# Altium schematic sheet Receiver-Sheet.SchDoc: 15W QI Wireless Charging Receiver
size 420 x 297 mm; SheetNumber: 1; SheetTotal: 1; ENG_APP_DATE: --/--/--; DSN_APP_DATE: --/--/--; CHK_APP_DATE: --/--/--
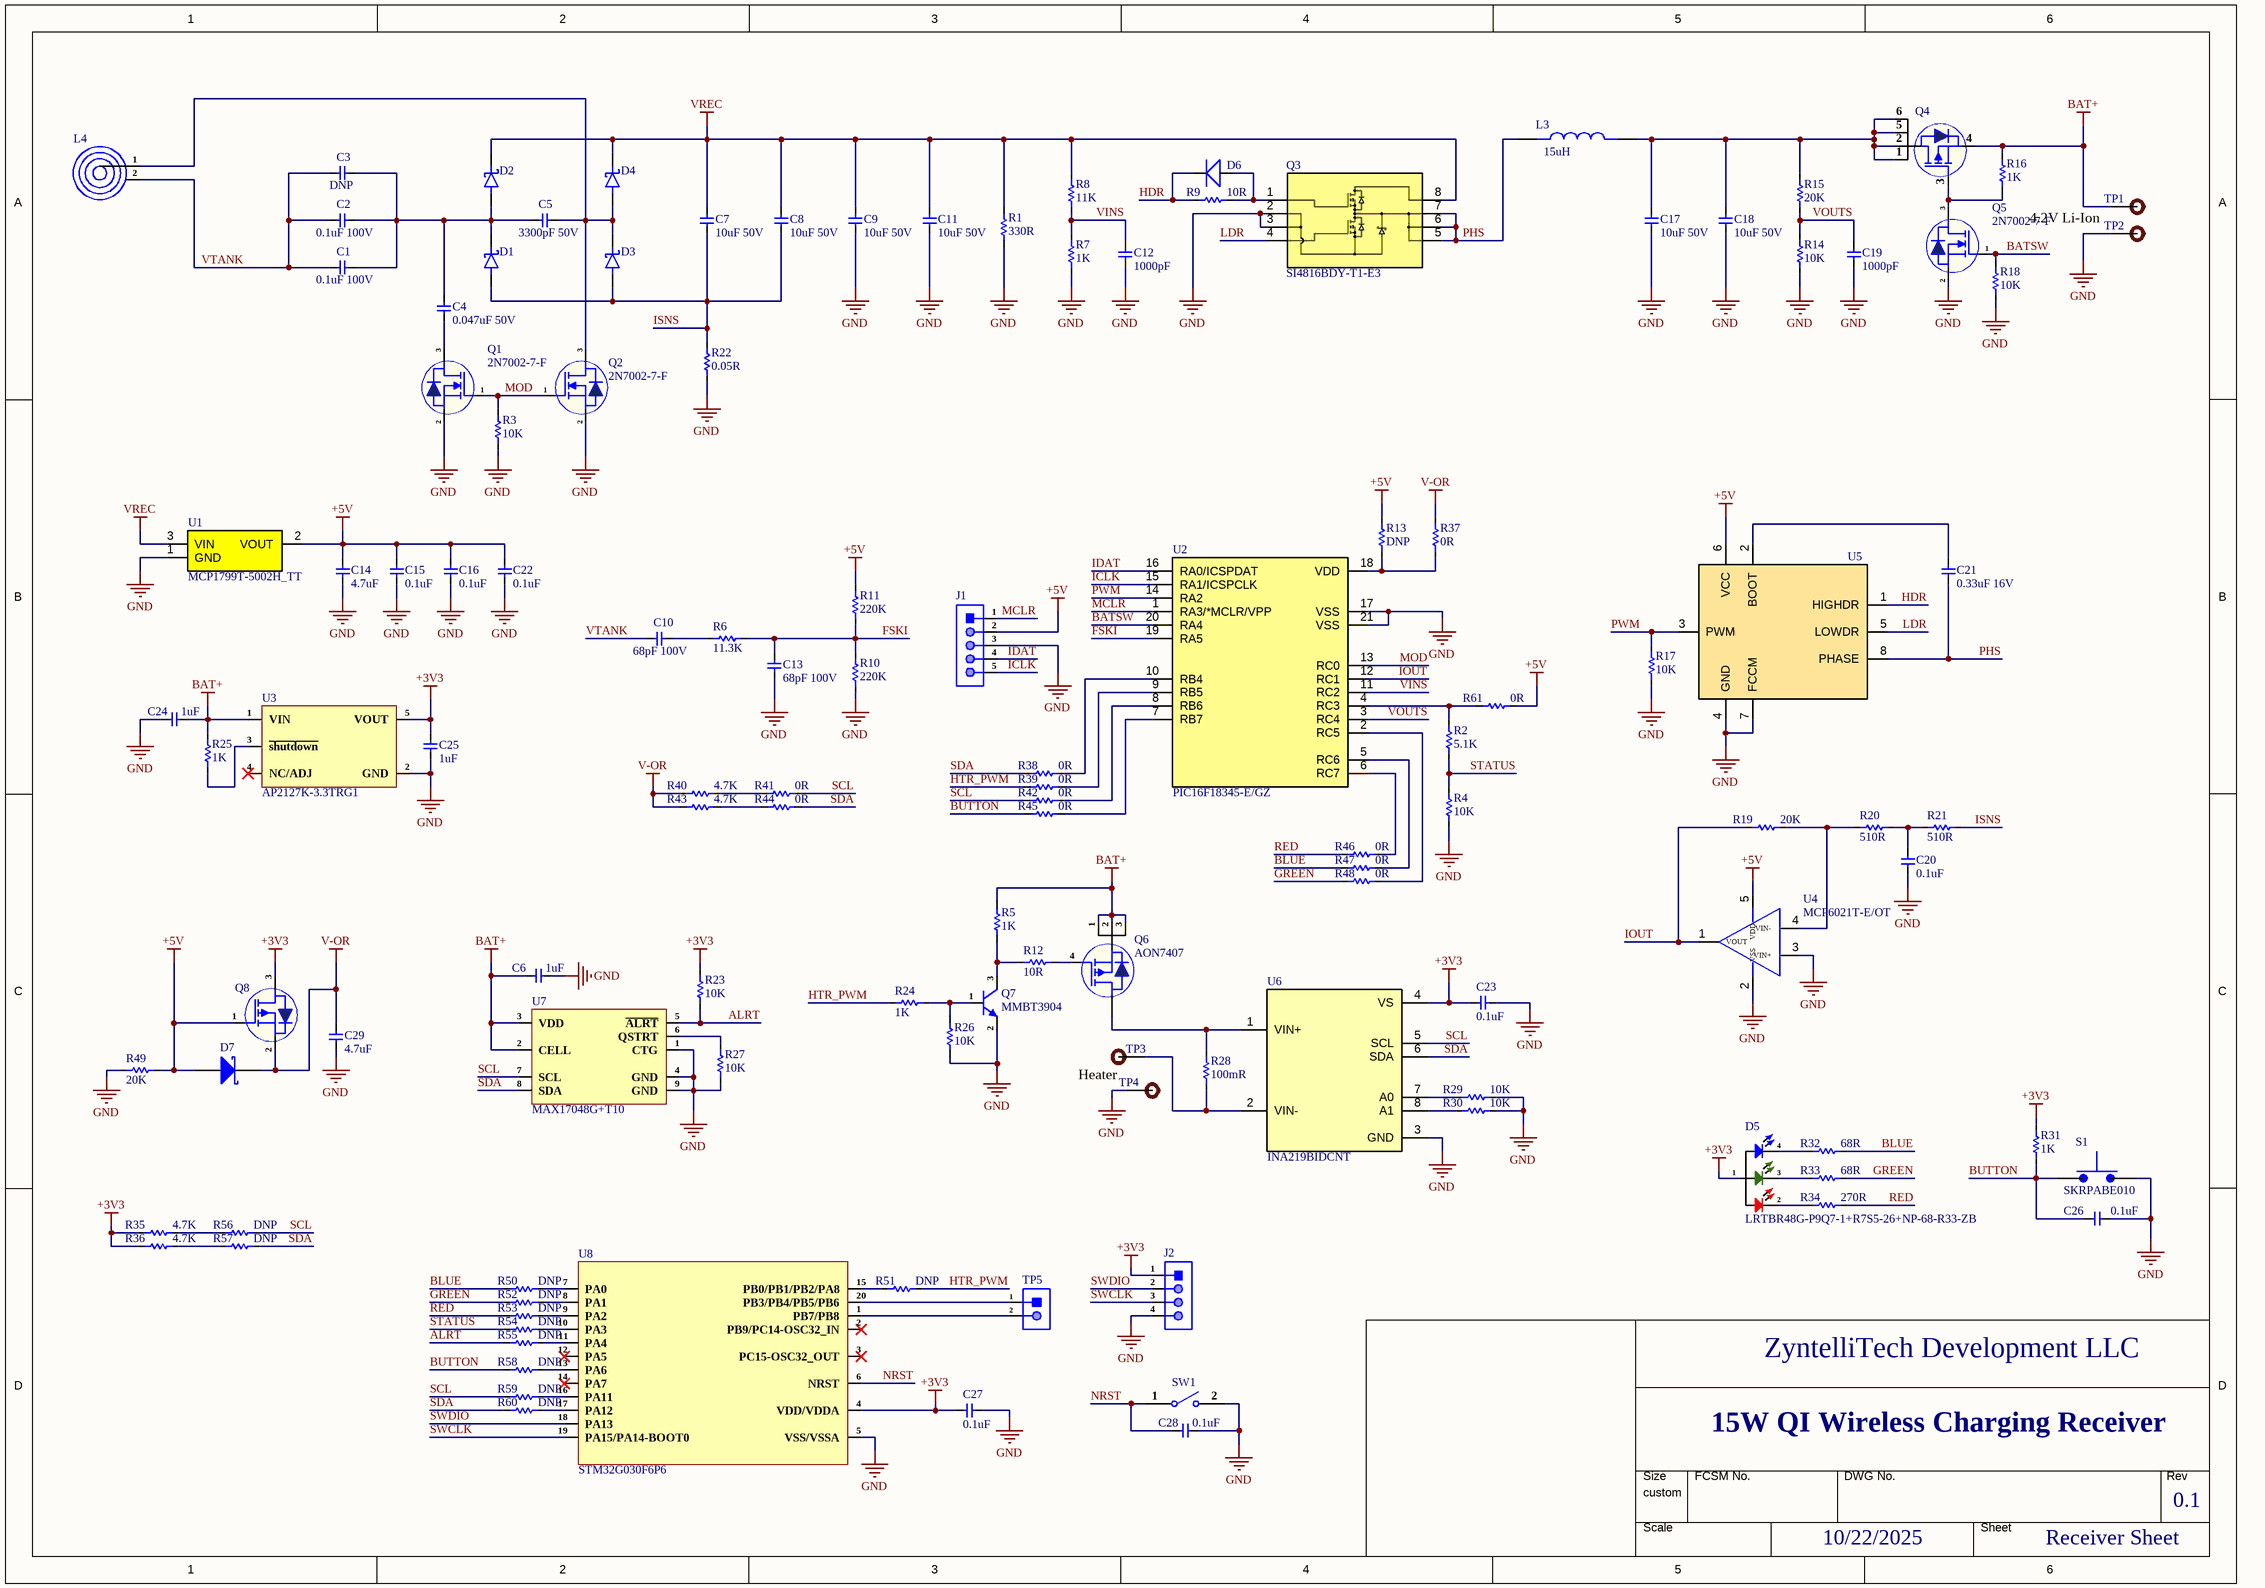
[diagram p0: Receiver-Sheet.SchDoc]

## Parts
C1  0.1uF 100V  [Cap-1206]
C2  0.1uF 100V  [Cap-1206]
C3  DNP  [Cap-1206]  (no BOM)
C4  0.047uF 50V  [Cap-0805]
C5  3300pF 50V  [Cap-0805]
C6  1uF  [Cap-0603]
C7  10uF 50V  [Cap-1210]
C8  10uF 50V  [Cap-1210]
C9  10uF 50V  [Cap-1210]
C10  68pF 100V  [Cap-0603]
C11  10uF 50V  [Cap-1210]
C12  1000pF  [Cap-0603]
C13  68pF 100V  [Cap-0603]
C14  4.7uF  [Cap-0805]
C15  0.1uF  [Cap-0603]
C16  0.1uF  [Cap-0603]
C17  10uF 50V  [Cap-1210]
C18  10uF 50V  [Cap-1210]
C19  1000pF  [Cap-0603]
C20  0.1uF  [Cap-0603]
C21  0.33uF 16V  [Cap-0603]
C22  0.1uF  [Cap-0603]
C23  0.1uF  [Cap-0603]
C24  1uF  [Cap-0603]
C25  1uF  [Cap-0603]
C26  0.1uF  [Cap-0603]
C27  0.1uF  [Cap-0603]
C28  0.1uF  [Cap-0603]
C29  4.7uF  [Cap-0805]
D1  PMEG6045ETPX  [DIO_PMEG6045ETPX]  (value not drawn)
D2  PMEG6045ETPX  [DIO_PMEG6045ETPX]  (value not drawn)
D3  PMEG6045ETPX  [DIO_PMEG6045ETPX]  (value not drawn)
D4  PMEG6045ETPX  [DIO_PMEG6045ETPX]  (value not drawn)
D5  LRTBR48G-P9Q7-1+R7S5-26+NP-68-R33-ZB  [LRTBR48G-P9Q7-1+R7S5-26+NP-68-R33-ZB]
D6  BAT54JFILM  [SOD-323]  (value not drawn)
D7  MBR120VLSFT3G  [SOD-123]  (value not drawn)
J1  X6511WV-05H-C60D30  [HDR1X5_]  (value not drawn)
J2  X6511WV-04H-C60D30  [HDR1X4_]  (value not drawn)
L3  15uH  [IND_XAL6060-153MEB]
L4  760308102207  [WE-WPCC_RX_760308102207]  (value not drawn)
Q1  2N7002-7-F  [SOT103P240X110-3N]
Q2  2N7002-7-F  [SOT103P240X110-3N]
Q3  SI4816BDY-T1-E3  [SOIC8_NARROW_VIS]
Q4  SI3433CDV-T1-GE3  [6-TSOP_]  (value not drawn)
Q5  2N7002-7-F  [SOT103P240X110-3N]
Q6  AON7407  [TRANS_AON7407]
Q7  MMBT3904  [SOT-23]
Q8  DMG3415U  [SOT-23]  (value not drawn)
R1  330R  [Res-1206]
R2  5.1K  [Res-0603]
R3  10K  [Res-0603]
R4  10K  [Res-0603]
R5  1K  [Res-0603]
R6  11.3K  [Res-0603]
R7  1K  [Res-0603]
R8  11K  [Res-0603]
R9  10R  [Res-0603]
R10  220K  [Res-0603]
R11  220K  [Res-0603]
R12  10R  [Res-0603]
R13  DNP  [Res-0603]  (no BOM)
R14  10K  [Res-0603]
R15  20K  [Res-0603]
R16  1K  [Res-0603]
R17  10K  [Res-0603]
R18  10K  [Res-0603]
R19  20K  [Res-0603]
R20  510R  [Res-0603]
R21  510R  [Res-0603]
R22  0.05R  [Res-1206]
R23  10K  [Res-0603]
R24  1K  [Res-0603]
R25  1K  [Res-0603]
R26  10K  [Res-0603]
R27  10K  [Res-0603]
R28  100mR  [RES-2512]
R29  10K  [Res-0603]
R30  10K  [Res-0603]
R31  1K  [Res-0603]
R32  68R  [Res-0603]
R33  68R  [Res-0603]
R34  270R  [Res-0603]
R35  4.7K  [Res-0603]
R36  4.7K  [Res-0603]
R37  0R  [Res-0603]
R38  0R  [Res-0603]
R39  0R  [Res-0603]
R40  4.7K  [Res-0603]
R41  0R  [Res-0603]
R42  0R  [Res-0603]
R43  4.7K  [Res-0603]
R44  0R  [Res-0603]
R45  0R  [Res-0603]
R46  0R  [Res-0603]
R47  0R  [Res-0603]
R48  0R  [Res-0603]
R49  20K  [Res-0603]
R50  DNP  [Res-0603]  (no BOM)
R51  DNP  [Res-0603]  (no BOM)
R52  DNP  [Res-0603]  (no BOM)
R53  DNP  [Res-0603]  (no BOM)
R54  DNP  [Res-0603]  (no BOM)
R55  DNP  [Res-0603]  (no BOM)
R56  DNP  [Res-0603]  (no BOM)
R57  DNP  [Res-0603]  (no BOM)
R58  DNP  [Res-0603]  (no BOM)
R59  DNP  [Res-0603]  (no BOM)
R60  DNP  [Res-0603]  (no BOM)
R61  0R  [Res-0603]
S1  SKRPABE010  [SW_SKRPABE010]
SW1  B3U-1000P  [B3U-1000P]  (value not drawn)
TP1  0.5mm Test Pad  [0.5mm Test Pad]  (value not drawn)  (no BOM)
TP2  0.5mm Test Pad  [0.5mm Test Pad]  (value not drawn)  (no BOM)
TP3  0.5mm Test Pad  [0.5mm Test Pad]  (value not drawn)  (no BOM)
TP4  0.5mm Test Pad  [0.5mm Test Pad]  (value not drawn)  (no BOM)
TP5  2 Test Pad  [2 Test Pad]  (value not drawn)  (no BOM)
U1  MCP1799T-5002H_TT  [SOT95P237X112-3N]
U2  PIC16F18345-E/GZ  [UQFN20_GZ_MCH]
U3  AP2127K-3.3TRG1  [SOT-23-5]
U4  MCP6021T-E/OT  [SOT95P270X145-5N]
U5  MCP14628-E/SN  [SOIC127P600X175-8N]  (value not drawn)
U6  INA219BIDCNT  [SOT65P280X145-8N]
U7  MAX17048G+T10  [8-TDFN-EP (2x2)]
U8  STM32G030F6P6  [TSSOP-20]

## Nets
+3V3: C23.2 C25.1 C27.2 D5.1(+) J2.1 Q8.3(D) R23.1 R31.1 R35.2 R36.2 U3.5(VOUT) U6.4(VS) U8.4(VDD/VDDA)
+5V: C14.2 C15.2 C16.2 C22.2 D7.1(A) J1.2 Q8.1(G) R11.2 R13.2 R49.1 R61.1 U1.2(VOUT) U4.5(VDD) U5.6(VCC)
BAT+: C6.2 C24.1 Q4.4(S) Q6.1(S) Q6.2(S) Q6.3(S) R5.2 R16.2 R25.1 TP1.1 U3.1(VIN) U7.2(CELL) U7.3(VDD)
GND: C6.1 C9.1 C11.1 C12.1 C13.1 C14.1 C15.1 C16.1 C17.1 C18.1 C19.1 C20.1 C22.1 C23.1 C24.2 C25.2 C26.1 C27.1 C28.1 C29.1 J1.3 J2.4 Q1.2(S) Q2.2(S) Q3.2 Q3.3 Q5.2(S) Q7.2(E) R1.1 R3.1 R4.1 R7.1 R10.1 R14.1 R17.1 R18.1 R22.1 R26.2 R27.2 R29.1 R30.1 R49.2 S1.3 SW1.2 TP2.1 TP4.1 U1.1(GND) U2.17(VSS) U2.21(VSS) U3.2(GND) U4.2(VSS) U4.3(VIN+) U5.4(GND) U5.7(FCCM) U6.3(GND) U7.1(CTG) U7.4(GND) U7.9(GND) U8.5(VSS/VSSA)
V-OR: C29.2 D7.2(K) Q8.2(S) R37.2 R40.2 R43.2
VREC: C7.2 C8.2 C9.2 C11.2 D2.K D4.K Q3.8 R1.2 R8.2 U1.3(VIN)
ALRT: R23.2 R55.1 U7.5(~{ALRT})
BATSW: Q5.1(G) R18.2 U2.20(RA4)
BLUE: R32.2 R47.2 R50.1
BUTTON: C26.2 R31.2 R45.2 R58.1 S1.1
FSKI: C13.2 R6.1 R10.2 R11.1 U2.19(RA5)
GREEN: R33.2 R48.2 R52.1
HDR: D6.NEG R9.1 U5.1(HIGHDR)
HTR_PWM: R24.2 R39.2 R51.2
ICLK: J1.5 U2.15(RA1/ICSPCLK)
IDAT: J1.4 U2.16(RA0/ICSPDAT)
IOUT: R19.2 U2.12(RC1) U4.1(VOUT)
ISNS: C7.1 C8.1 D1.A D3.A R21.2 R22.2
LDR: Q3.4 U5.5(LOWDR)
MCLR: J1.1 U2.1(RA3/*MCLR/VPP)
MOD: Q1.1(G) Q2.1(G) R3.2 U2.13(RC0)
NRST: C28.2 SW1.1 U8.6(NRST)
PHS: C21.1 L3.1 Q3.5 Q3.6 Q3.7 U5.8(PHASE)
PWM: R17.2 U2.14(RA2) U5.3(PWM)
RED: R34.2 R46.2 R53.1
SCL: R41.1 R42.2 R56.2 R59.1 U6.5(SCL) U7.7(SCL)
SDA: R38.2 R44.1 R57.2 R60.1 U6.6(SDA) U7.8(SDA)
STATUS: R2.1 R4.2 R54.1
SWCLK: J2.3 U8.19(PA15/PA14-BOOT0)
SWDIO: J2.2 U8.18(PA13)
VINS: C12.2 R7.2 R8.1 U2.11(RC2)
VOUTS: C19.2 R14.2 R15.1 U2.3(RC4)
VTANK: C1.1 C2.1 C3.1 C10.1 L4.2
NetC1_2: C1.2 C2.2 C3.2 C4.2 C5.1 D1.K D2.A
NetC4_1: C4.1 Q1.3(D)
NetC5_2: C5.2 D3.K D4.A L4.1 Q2.3(D)
NetC10_2: C10.2 R6.2
NetC17_2: C17.2 C18.2 L3.2 Q4.1(D) Q4.2(D) Q4.5(D) Q4.6(D) R15.2
NetC20_2: C20.2 R20.2 R21.1
NetC21_2: C21.2 U5.2(BOOT)
NetD5_2: D5.2(-RED) R34.1
NetD5_3: D5.3(-GREEN) R33.1
NetD5_4: D5.4(-BLUE) R32.1
NetD6_POS: D6.POS Q3.1 R9.2
NetQ4_3: Q4.3(G) Q5.3(D) R16.1
NetQ6_4: Q6.4(G) R12.1
NetQ6_5_6_7_8: Q6.5_6_7_8(D) R28.2 U6.1(VIN+)
NetQ7_1: Q7.1(B) R24.1 R26.1
NetQ7_3: Q7.3(C) R5.1 R12.2
NetR2_2: R2.2 R61.2 U2.4(RC3)
NetR13_1: R13.1 R37.1 U2.18(VDD)
NetR19_1: R19.1 R20.1 U4.4(VIN-)
NetR25_2: R25.2 U3.3(~{shutdown})
NetR27_1: R27.1 U7.6(QSTRT)
NetR28_1: R28.1 TP3.1 U6.2(VIN-)
NetR29_2: R29.2 U6.7(A0)
NetR30_2: R30.2 U6.8(A1)
NetR35_1: R35.1 R56.1
NetR36_1: R36.1 R57.1
NetR38_1: R38.1 U2.10(RB4)
NetR39_1: R39.1 U2.9(RB5)
NetR40_1: R40.1 R41.2
NetR42_1: R42.1 U2.8(RB6)
NetR43_1: R43.1 R44.2
NetR45_1: R45.1 U2.7(RB7)
NetR46_1: R46.1 U2.6(RC7)
NetR47_1: R47.1 U2.5(RC6)
NetR48_1: R48.1 U2.2(RC5)
NetR50_2: R50.2 U8.7(PA0)
NetR51_1: R51.1 U8.15(PB0/PB1/PB2/PA8)
NetR52_2: R52.2 U8.8(PA1)
NetR53_2: R53.2 U8.9(PA2)
NetR54_2: R54.2 U8.10(PA3)
NetR55_2: R55.2 U8.11(PA4)
NetR58_2: R58.2 U8.13(PA6)
NetR59_2: R59.2 U8.16(PA11)
NetR60_2: R60.2 U8.17(PA12)
NetTP5_1: TP5.1 U8.20(PB3/PB4/PB5/PB6)
NetTP5_2: TP5.2 U8.1(PB7/PB8)

Not connected (* = marked no-connect by the designer): S1 2(1) 4(2); U3 4(NC/ADJ)*; U8 2(PB9/PC14-OSC32_IN)* 3(PC15-OSC32_OUT)* 12(PA5)* 14(PA7)*

## Notes on the sheet
- 4.2V Li-Ion
- (near TP3) Heater
- ZyntelliTech Development LLC
- 15W QI Wireless Charging Receiver
- 0.1
- 10/22/2025
- Receiver Sheet
- THIS DOCUMENT AND THE DATA DISCLOSED HEREIN OR
- HEREWITH IS THE PROPERTY OF ALTIUM LIMITED AND MAY
- DWG NO:
- REVISION
- REV:
- DESCRIPTION
- DATE
- APPROVED
- BE FREELY DISTRIBUTED IN WHOLE. NO RIGHTS ARE
- RESERVED OR EXPRESS OR IMPLIED WARANTEE GIVEN.
- ENG:
- APPROVALS
- PROJECT
- DSN:
- CHK:
- REFERENCE DOCUMENTS
- PROJECT REVISION:
- TITLE
- DOCUMENT REVISION:
- DESIGN ITEM:
- BOM:
- FAB DWG:
- PCB DWG:
- ASSY DWG:
- SCALE:
- A3
- SIZE
- CAGE CODE
- FILE NAME
- DWG NO.
- SHEET
- OF
- REV

## Library data of the parts
C1-C3 = CAP-1206: CC1206KKX7R0BB104 - CAP CER 0.1uF 100V 10% X7R SMD 1206
C4 = CAP-0805: C0805C473K5RACTU - CAP CER 0.047uF 50V 10% X7R SMD 0805
C5 = CAP-0805: 885012007066 - CAP CER 3300pF 50V 5% NP0 SMD 0805
C6 C24 C25 = CAP-0603
C7-C9 C11 C17 C18 = CAP-1210: UMK325AB7106MM - CAP CER 10uF 50V 20% X7R SMD 1210
C10 C13 = CAP-0603: C0603C680J1GACTU - CAP CER 68pF 100V 5% C0G SMD 0603
C12 C19 = CAP-0603: NMC0603X7R102K50TRPF - CAP CER 1000pF 50V 20% X7R SMD 0603
C14 C29 = CAP-0805: C2012X5R1E475M125AB - CAP CER 4.7uF 25V 20% X5R SMD 0805
C15 C16 C22 C26 = CAP-0603: 06033C104JAT2A - CAP CER 0.1uF 25V 5% X7R SMD 0603
C20 C23 C27 C28 = CAP-0603: CL10B104KO8NNNC - CAP CER 0.1uF 16V 10% X7R SMD 0603
C21 = CAP-0603: 885012206049 - CAP CER 0.33uF 16V 10% X7R SMD 0603
D1-D4 = PMEG6045ETPX: Rectifier Diode Schottky 4.5A 20ns Automotive 2-Pin SOD-128 T/R; MF: Nexperia; SnapEDA_Link: https://www.snapeda.com/parts/PMEG6045ETPX/Nexperia/view-part/?ref=snap; Package: CFP5-2 Nexperia USA Inc.; Value: *; MP: PMEG6045ETPX; Check_prices: https://www.snapeda.com/parts/PMEG6045ETPX/Nexperia/view-part/?ref=eda
D6 = BAT54JFILM: MF: STMicroelectronics; Package: SOD-323 STMicroelectronics; Price: None; Check_prices: https://www.snapeda.com/parts/BAT54JFILM/STMicroelectronics/view-part/?ref=eda; Value: *; SnapEDA_Link: https://www.snapeda.com/parts/BAT54JFILM/STMicroelectronics/view-part/?ref=snap; MP: BAT54JFILM; Availability: In Stock; Purchase-URL: https://pricing.snapeda.com/search/part/BAT54JFILM/?ref=eda
D7 = MBR120VLSFT3G: DIODE SCHOTTKY 20V 1A SOD123FL; Manufacturer: ON Semiconductor; Max Surge Current: 45A; Forward Voltage: 340mV; Peak Reverse Current: 600uA; Element Configuration: Single; Polarity: Standard; Supplier 1: Digi-Key; Manufacturer Part Number: MBR120VLSFT3G; Stock 1: 130499; Pricing 1: 1=0.42, 10=0.338, 100=0.2298, 500=0.17234, 1000=0.12926 (USD); Number of Pins: 2; Min Operating Temperature: -65°C; Max Operating Temperature: 125°C; Package Quantity: 10000; Forward Current: 1A; Packaging: Tape and Reel; Max Reverse Leakage Current: 600uA; Average Rectified Current: 1A; Peak Non-Repetitive Surge Current: 45A; Max Repetitive Reverse Voltage (Vrrm): 20V; Max Forward Surge Current (Ifsm): 45A; Voltage Rating (DC): 20V; Current Rating: 1A; Output Current: 1A; Max Reverse Voltage (DC): 20V; Radiation Hardening: No; REACH SVHC: No SVHC; Lead Free: Lead Free; Halogen Free: Halogen Free; ComponentLink1URL: http://www.mouser.com/ds/2/308/MBR120VLSFT1-D-107081.pdf?src-supplier=Mouser; ComponentLink1Description: http://www.mouser.com/ds/2/308/MBR120VLSFT1-D-107081.pdf?src-supplier=Mouser; ComponentLink2URL: http://www.onsemi.com/pub/Collateral/MBR120VLSFT1-D.PDF?src-supplier=Digi-Key; ComponentLink2Description: http://www.onsemi.com/pub/Collateral/MBR120VLSFT1-D.PDF?src-supplier=Digi-Key; ComponentLink3URL: http://www.onsemi.cn/pub_link/Collateral/MBR120VLSFT1-D.PDF?src-supplier=Avnet; ComponentLink3Description: http://www.onsemi.cn/pub_link/Collateral/MBR120VLSFT1-D.PDF?src-supplier=Avnet; Supplier Part Number 1: MBR120VLSFT3GOSCT-ND; LCSC Part Number: C295749
J1 = X6511WV-05H-C60D30: Gold 250V 3A Straight Square Pins 2.5mm 5P 260℃ 6mm -40℃~+105℃ 3mm 2.54mm Plugin Black Brass 1x5P Plugin,P=2.54mm Pin Headers ROHS; Manufacturer: XKB; Item Type: Male Header; ComponentLink1Description: LCSC; ComponentLink1URL: https://www.lcsc.com/product-detail/Pin-Headers_XKB-Connectivity-X6511WV-05H-C60D30_C706877.html; Manufacturer Part Number: X6511WV-05H-C60D30; Package: Plugin,P=2.54mm; LCSC Part Number: C706877
J2 = X6511WV-04H-C60D30: Gold 250V 3A Straight Square Pins 2.5mm 4P 260℃ 6mm -40℃~+105℃ 3mm 2.54mm Plugin Black Brass 1x4P Plugin,P=2.54mm Pin Headers ROHS; Manufacturer: XKB; Item Type: Male Header; ComponentLink1Description: LCSC; ComponentLink1URL: https://www.lcsc.com/product-detail/Pin-Headers_XKB-Connectivity-X6511WV-04H-C60D30_C706876.html; Manufacturer Part Number: X6511WV-04H-C60D30; Package: Plugin,P=2.54mm; LCSC Part Number: C706876
L3 = XAL6060-153MEB: Power inductor, shielded, 20% tol, SMT, RoHS, halogen f; MF: Coilcraft; SnapEDA_Link: https://www.snapeda.com/parts/XAL6060-153MEB/Coilcraft/view-part/?ref=snap; Package: None; Value: *; MP: XAL6060-153MEB; Check_prices: https://www.snapeda.com/parts/XAL6060-153MEB/Coilcraft/view-part/?ref=eda
L4 = 760308102207: RX 1 COIL 1 LYR BIFILAR 8UH 5A; MF: WÃ¼rth Elektronik; SnapEDA_Link: https://www.snapeda.com/parts/760308102207/W%25C3%25BCrth+Elektronik+Midcom/view-part/?ref=snap; Package: WÃ¼rth Elektronik; Value: *; MP: 760308102207; Check_prices: https://www.snapeda.com/parts/760308102207/W%25C3%25BCrth+Elektronik+Midcom/view-part/?ref=eda
Q1 Q2 Q5 = 2N7002-7-F: N-Channel 60 V 115mA (Ta) 370mW (Ta) Surface Mount SOT-23-3; MF: Diodes Inc.; Purchase-URL: https://pricing.snapeda.com/search/part/2N7002-7-F/?ref=eda; Package: SOT-23-3 Diodes Inc.; MP: 2N7002-7-F; Price: None; Availability: In Stock; Value: *; Check_prices: https://www.snapeda.com/parts/2N7002-7-F/Diodes+Inc./view-part/?ref=eda; SnapEDA_Link: https://www.snapeda.com/parts/2N7002-7-F/Diodes+Inc./view-part/?ref=snap
Q3 = SI4816BDY-T1-E3: DUAL N-CH 30-V (D-S) MOSFET W/SCHOTTKY; Manufacturer_Name: Vishay; Copyright: Copyright (C) 2025 Ultra Librarian. All rights reserved.; Manufacturer_Part_Number: SI4816BDY-T1-E3; Datasheet: https://www.vishay.com/doc?73026; RefDes: RefDes; Type: Type
Q6 = AON7407: P-Channel 20 V 14.5A (Ta), 40A (Tc) 3.1W (Ta), 29W (Tc) Surface Mount 8-DFN-EP (3x3); MF: Alpha & Omega Semiconductor Inc.; SnapEDA_Link: https://www.snapeda.com/parts/AON7407/Alpha+%2526+Omega+Semiconductor+Inc./view-part/?ref=snap; Package: PowerVDFN-8 Alpha &amp; Omega Semiconductor Inc.; Value: *; MP: AON7407; Check_prices: https://www.snapeda.com/parts/AON7407/Alpha+%2526+Omega+Semiconductor+Inc./view-part/?ref=eda
Q7 = MMBT3904: 40V 200mW 100 200mA NPN SOT-23 Bipolar (BJT) ROHS; Manufacturer: ElecSuper; Item Type: (BJT); Manufacturer Part Number: MMBT3904; Package: SOT-23; LCSC Part Number: C5249683; ComponentLink1Description: LCSC; ComponentLink1URL: https://www.lcsc.com/product-detail/Bipolar-BJT_ElecSuper-MMBT3904_C5249683.html
Q8 = DMG3415U: P-Channel MOSFETs ROHS; Manufacturer: TECH PUBLIC; Item Type: MOSFET; Manufacturer Part Number: DMG3415U; Package: SOT-23; LCSC Part Number: C7202986; ComponentLink1Description: LCSC; ComponentLink1URL: https://www.lcsc.com/product-detail/MOSFETs_TECH-PUBLIC-DMG3415U_C7202986.html
R1 = RES-1206: CRCW1206330RFKTA - RES TKF 330R 1% 1/4W SMD 1206
R2 R32-R48 R61 = RES-0603
R3 R4 R14 R17 R18 R23 R26 R27 R29 R30 = RES-0603: CPF0603F10KC1 - RES TF 10k 1% 1/16W SMD 0603
R5 R16 R24 R25 R31 = RES-0603: RMCF0603FT1K00 - RES TKF 1k 1% 1/10W SMD 0603
R6 = RES-0603: CRCW060311K3FKEA - RES TKF 11.3k 1% 1/10W SMD 0603
R7 = RES-0603: MC0063W060311K - RES TKF 1k 1% 1/16W SMD 0603
R8 = RES-0603: ERJ-3EKF1102V - RES TKF 11k 1% 1/10W SMD 0603
R9 = RES-0603: ERJ3EKF10R0V - RES TKF 10R 1% 1/10W SMD 0603
R10 R11 = RES-0603: ERJ-3EKF2203V - RES TKF 220k 1% 1/10W SMD 0603
R12 = RES-0603: RC0603FR-0710RL - 10R 0603
R13 R50-R60 = RES-0603: 0R
R15 R19 R49 = RES-0603: RC0603FR-0720KL - RES TKF 20k 1% 1/10W SMD 0603
R20 R21 = RES-0603: CRCW0603510RFKEA - RES TKF 510R 1% 1/10W SMD 0603
R22 = RES-1206: WSLP1206R0500FEA - RES MS 0.05R 1% 1W SMD 1206
R28 = RES-2512: CRA2512-FZ-R100ELF - RES 0.1 OHM 1% 3W 2512
S1 = SKRPABE010: Switch Tactile N.O. SPST Button J-Bend 0.05A 16VDC 1.57N SMD Automotive T/R; MF: ALPS; SnapEDA_Link: https://www.snapeda.com/parts/SKRPABE010/ALPS/view-part/?ref=snap; Package: None; Value: *; MP: SKRPABE010; Check_prices: https://www.snapeda.com/parts/SKRPABE010/ALPS/view-part/?ref=eda
SW1 = B3U-1000P: SWITCH TACTILE SPST-NO 0.05A 12V; Manufacturer: Omron; Mechanical Life: 200000Cycles; Operating Force: 1.5N; Throw Configuration: SPST; Current Rating: 50mA; Contact Resistance: 100mR; Illumination Type: Non-Illuminated,Illuminated; Switch Travel: 0.15mm; Switch Function: Off-Mom; Actuator Type: Standard; Actuator Length: 0.4mm; Ratings: Dust Proof,IP40; ComponentLink1URL: http://www.farnell.com/datasheets/60838.pdf?src-supplier=Farnell; ComponentLink1Description: http://www.farnell.com/datasheets/60838.pdf?src-supplier=Farnell; ComponentLink2URL: http://www.farnell.com/datasheets/60838.pdf?src-supplier=Element14; ComponentLink2Description: http://www.farnell.com/datasheets/60838.pdf?src-supplier=Element14; ComponentLink3URL: https://omronfs.omron.com/en_US/ecb/products/pdf/en-b3u.pdf?src-supplier=Digi-Key; ComponentLink3Description: https://omronfs.omron.com/en_US/ecb/products/pdf/en-b3u.pdf?src-supplier=Digi-Key; ComponentLink4URL: http://www.omron.com/ecb/products/pdf/en-b3u.pdf?src-supplier=Digi-Key; ComponentLink4Description: http://www.omron.com/ecb/products/pdf/en-b3u.pdf?src-supplier=Digi-Key; ComponentLink5URL: https://www.distrelec.biz/Web/Downloads/he/et/B3U_eng_datasheet.pdf?mime=application%2Fpdf&src-supplier=Distrelec; ComponentLink5Description: https://www.distrelec.biz/Web/Downloads/he/et/B3U_eng_datasheet.pdf?mime=application%2Fpdf&src-supplier=Distrelec; ComponentLink6URL: http://www.onlinecomponents.com/productFiles/mf-OM/en-b3u.pdf?src-supplier=Onlinecomponents.com; ComponentLink6Description: http://www.onlinecomponents.com/productFiles/mf-OM/en-b3u.pdf?src-supplier=Onlinecomponents.com; Supplier 1: Digi-Key; Manufacturer Part Number: B3U-1000P; Stock 1: 116454; Pricing 1: 1=1, 10=0.961, 25=0.9064, 50=0.7976, 100=0.7251, 250=0.68888, 500=0.67074, 1000=0.52571 (USD); Mount: Surface Mount; Weight: 0.000776oz; Contact Material: Silver; Min Operating Temperature: -25°C; Max Operating Temperature: 70°C; Packaging: Tape and Reel; Voltage Rating (DC): 12V; Package Quantity: 1; Max Current Rating: 50mA; Termination: SMD/SMT; Orientation: Straight; Max Voltage Rating (DC): 12V; Electrical Life: 200000Cycles; Insulation Resistance: 100MR; Contact Current Rating: 50mA; Length: 4mm; Height: 1.2mm; Depth: 2.5mm; Width: 3mm; REACH SVHC: Unknown; Lead Free: Lead Free; ComponentLink7URL: https://www.verical.com/server-webapp/html/getDatasheet?partID=552554&src-supplier=Verical; ComponentLink7Description: https://www.verical.com/server-webapp/html/getDatasheet?partID=552554&src-supplier=Verical; ComponentLink8URL: http://www.farnell.com/datasheets/1685550.pdf?src-supplier=Element14; ComponentLink8Description: http://www.farnell.com/datasheets/1685550.pdf?src-supplier=Element14; ComponentLink9URL: http://www.farnell.com/datasheets/2610940.pdf?src-supplier=Farnell; ComponentLink9Description: http://www.farnell.com/datasheets/2610940.pdf?src-supplier=Farnell; ComponentLink10URL: https://www.alliedelec.com/m/d/4c8a9ef82804fc3c241a13c1e298fd73.pdf?src-supplier=Allied+Electronics; ComponentLink10Description: https://www.alliedelec.com/m/d/4c8a9ef82804fc3c241a13c1e298fd73.pdf?src-supplier=Allied+Electronics; Supplier Part Number 1: SW1020DKR-ND; LCSC Part Number: C231329; Item Type: Switch
TP1-TP4 = 0.5mm Test Pad: Test pad
TP5 = 2 Test Pad: Wire Connecting Pad; Item Type: Test Point; Manufacturer Part Number: 2 Test Pad
U1 = MCP1799T-5002H_TT: Linear Voltage Regulator IC Positive Fixed 1 Output  80mA SOT-23-3; MF: Microchip Technology; MP: MCP1799T-5002H/TT; SnapEDA_Link: https://www.snapeda.com/parts/MCP1799T-5002H/TT/Microchip/view-part/?ref=snap; Package: TO-236-3 Microchip Technology; Value: *; Check_prices: https://www.snapeda.com/parts/MCP1799T-5002H/TT/Microchip/view-part/?ref=eda
U2 = PIC16F18345-EGZ: No Description Available; Manufacturer_Name: Microchip; Type: Embedded; Copyright: Copyright (C) 2025 Ultra Librarian. All rights reserved.; Manufacturer_Part_Number: PIC16F18345-E/GZ; RefDes: RefDes
U3 = AP2127K-3.3TRG1: IC REG LINEAR 3.3V 300MA SOT23-5; Manufacturer: Diodes; Supplier: Arrow Electronics; LCSC Part Number: C156285; Manufacturer Part Number: AP2127K-3.3TRG1; RoHS: Yes; Item Type: IC; Stock: 45000; Pricing: 3000=0.0623, 6000=0.0623 (USD); ComponentLink1URL: https://datasheet.ciiva.com/30016/ap2127-30016760.pdf?src-supplier=Avnet; ComponentLink1Description: https://datasheet.ciiva.com/30016/ap2127-30016760.pdf?src-supplier=Avnet; ComponentLink2URL: https://datasheet.ciiva.com/29569/ap2127-29569893.pdf?src-supplier=Digikey; ComponentLink2Description: https://datasheet.ciiva.com/29569/ap2127-29569893.pdf?src-supplier=Digikey
U4 = MCP6021T-E/OT: IC OPAMP GP 1 CIRCUIT SOT23-5; MF: Microchip Technology; DigiKey-Purchase-URL: https://snapeda.com/shop?store=DigiKey&id=4816934; MP: MCP6021T-E/OT; Availability: Unavailable; Arrow_Electronics-Purchase-URL: https://snapeda.com/shop?store=Arrow+Electronics&id=4816934; Package: None; Mouser-Purchase-URL: https://snapeda.com/shop?store=Mouser&id=4816934; SnapEDA_Link: https://www.snapeda.com/parts/MCP6021T-E/OT/Atmel/view-part/4816934/?ref=snap; Value: *; Price: None
U5 = MCP14628-E/SN: Microchip MCP14628-E/SN, Dual MOSFET Power Driver 2A, 4.5 to 5.5 V, 8-Pin SOIC | Microchip Technology Inc. MCP14628-E/SN; SnapEDA_Link: https://www.snapeda.com/parts/MCP14628-E/SN/Microchip+Technology/view-part/?ref=snap; Package: SOIC-8 Microchip; Value: *; MF: Microchip; MP: MCP14628-E/SN; Check_prices: https://www.snapeda.com/parts/MCP14628-E/SN/Microchip+Technology/view-part/?ref=eda
U6 = INA219BIDCNT: 26-V 12-bit I2C output digital power monitor; MF: Texas Instruments; SnapEDA_Link: https://www.snapeda.com/parts/INA219BIDCNT/Texas+Instruments/view-part/?ref=snap; Package: SOT-23-8 Texas Instruments; Value: *; MP: INA219BIDCNT; Check_prices: https://www.snapeda.com/parts/INA219BIDCNT/Texas+Instruments/view-part/?ref=eda
U7 = MAX17048G+T10: IC BATT MON LI-ION 1CELL 8TDFN; Manufacturer: Maxim; Output Voltage: 400mV; Operating Supply Current: 23uA; Operating Supply Voltage: 4.5V; Supplier 1: Mouser; Manufacturer Part Number: MAX17048G+T10; RoHS: Yes; Category: Battery Management; Stock 1: 41293; Pricing 1: 1=3.34000, 10=3.00000, 50=2.84000, 100=2.46000, 1000=1.89000, 10000=1.83000 (USD); Mount: Surface Mount; Number of Pins: 8; Contact Plating: Tin,Matte; Min Operating Temperature: -20°C; Max Operating Temperature: 85°C; Packaging: Tape and Reel; Package Quantity: 10000; Series: ModelGauge™; Radiation Hardening: No; RoHS Compliant: Yes; ComponentLink1URL: https://datasheet.ciiva.com/14083/max17048-max17049-14083973.pdf?src-supplier=Digi-Key; ComponentLink1Description: https://datasheet.ciiva.com/14083/max17048-max17049-14083973.pdf?src-supplier=Digi-Key; Supplier Part Number 1: 700-MAX17048G+T10; LCSC Part Number: C2682616; Item Type: IC
U8 = STM32G030F6P6: IC MCU 32BIT 32KB FLASH 20TSSOP; Manufacturer: STMicroelectronics; Supplier: Future Electronics; LCSC Part Number: C724040; Manufacturer Part Number: STM32G030F6P6; RoHS: Yes; Item Type: IC; Stock: 15; Pricing: 20=0.745, 296=0.71, 1110=0.68, 1850=0.67, 3700=0.635 (USD); ComponentLink1URL: http://www.farnell.com/datasheets/2882477.pdf?src-supplier=Farnell; ComponentLink1Description: http://www.farnell.com/datasheets/2882477.pdf?src-supplier=Farnell; ComponentLink2URL: https://www.st.com/resource/en/datasheet/stm32g030c6.pdf?src-supplier=Digikey; ComponentLink2Description: https://www.st.com/resource/en/datasheet/stm32g030c6.pdf?src-supplier=Digikey; ComponentLink3URL: https://datasheet.octopart.com/STM32G030F6P6-STMicroelectronics-datasheet-137692524.pdf?src-supplier=TME; ComponentLink3Description: https://datasheet.octopart.com/STM32G030F6P6-STMicroelectronics-datasheet-137692524.pdf?src-supplier=TME